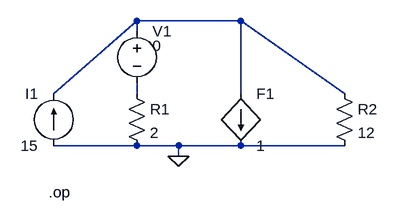
[diagram p0: schematic Draft1.asc]
Draft1.asc, the LTspice schematic file:
Version 4
SHEET 1 880 680
WIRE 496 128 336 128
WIRE 336 144 336 128
WIRE 208 240 336 128
WIRE 336 240 336 224
WIRE 496 240 496 128
WIRE 656 240 496 128
WIRE 336 320 208 320
WIRE 400 320 336 320
WIRE 496 320 400 320
WIRE 656 320 496 320
WIRE 400 336 400 320
FLAG 400 336 0
SYMBOL Res 320 224 R0
SYMATTR InstName R1
SYMATTR Value 2
SYMBOL Res 640 224 R0
SYMATTR InstName R2
SYMATTR Value 12
SYMBOL current 208 320 R180
WINDOW 0 24 80 Left 2
WINDOW 3 24 0 Left 2
SYMATTR InstName I1
SYMATTR Value 15
SYMBOL f 496 240 R0
SYMATTR InstName F1
SYMATTR Value 1
SYMATTR SpiceModel V1
SYMBOL Voltage 336 128 R0
WINDOW 3 24 38 Left 2
SYMATTR InstName V1
SYMATTR Value 0
TEXT 200 392 Left 2 !.op

The netlist it stands for:
* Draft1.asc
R1 N002 0 2
R2 N001 0 12
I1 0 N001 15
F1 N001 0 V1 1
V1 N001 N002 0
.op
.backanno
.end